# EAGLE design Dotblox64d (EAGLE 4.16)
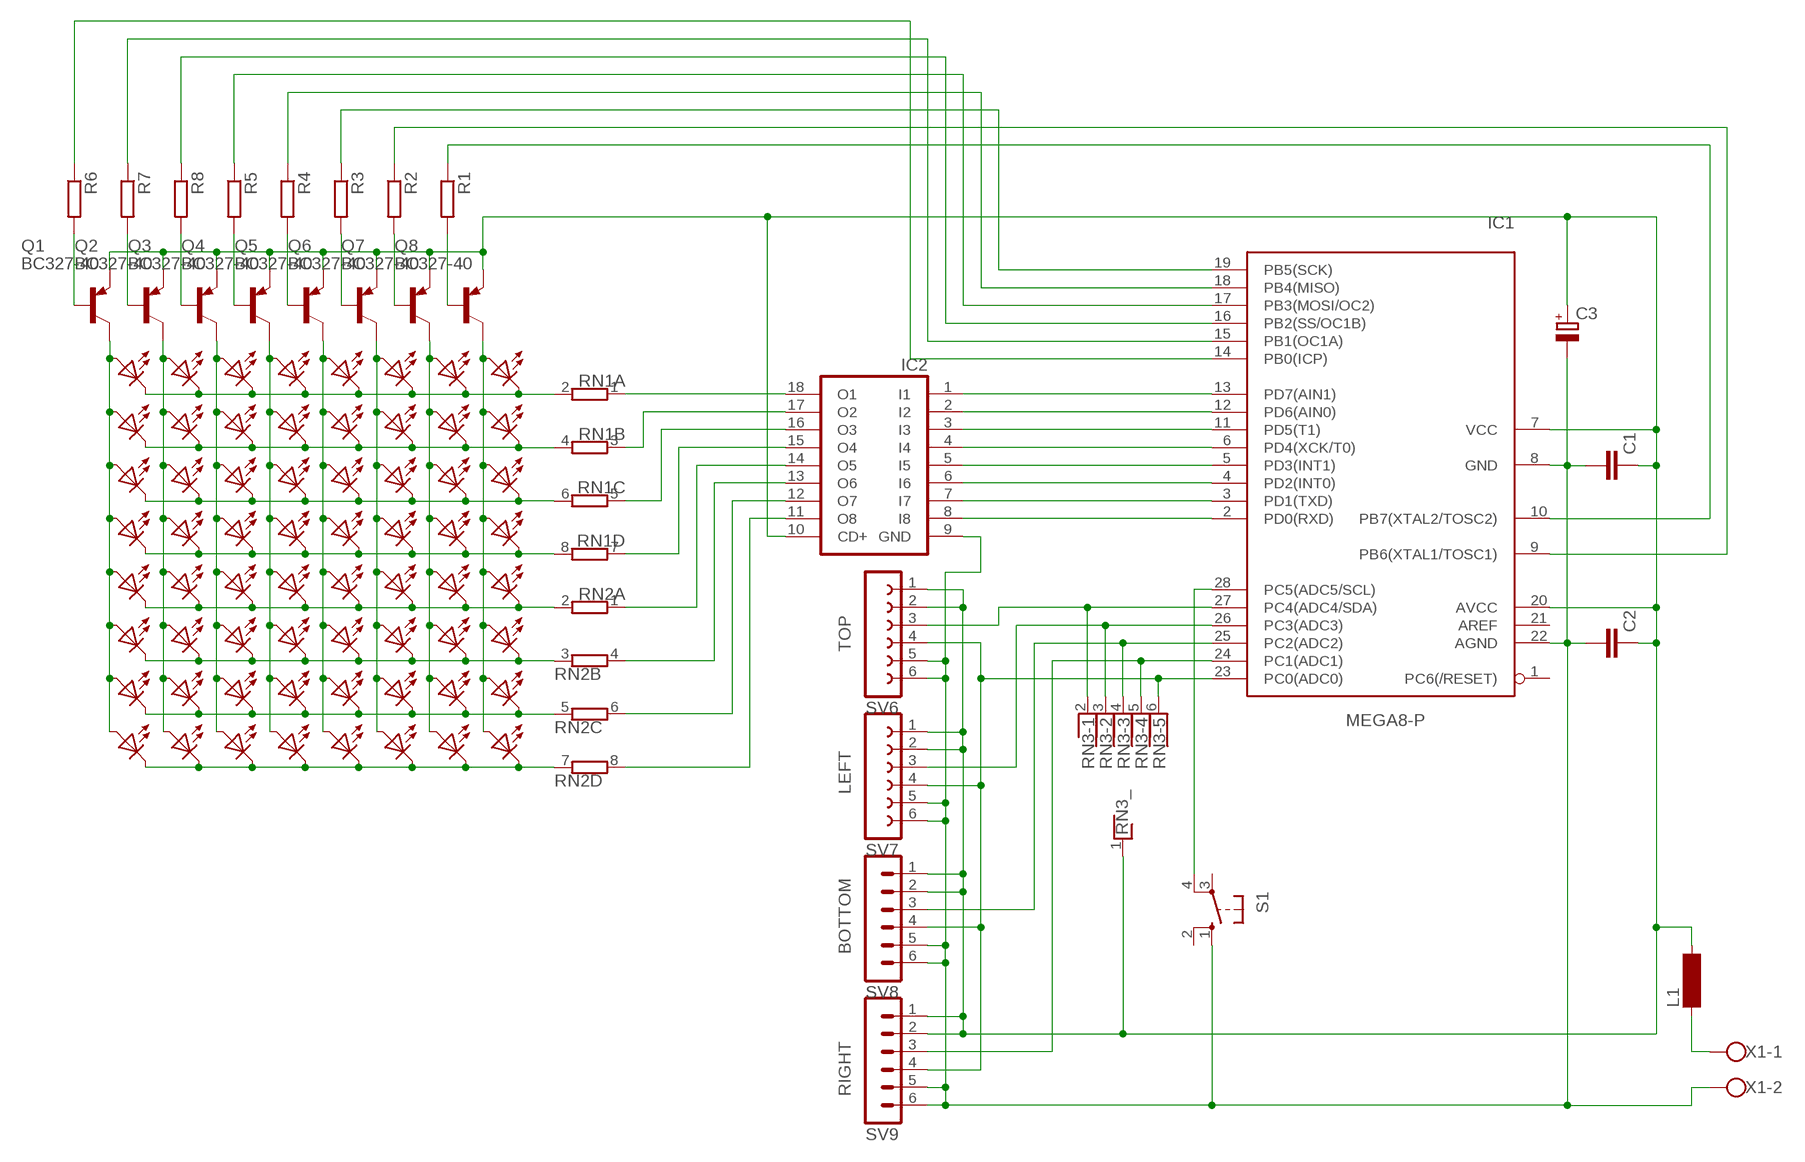
[diagram p0: schematic, sheet 1]

## Parts
C1  C-EU025-025X050  [C025-025X050]
C2  C-EU025-025X050  [C025-025X050]
C3  CPOL-EUE3.5-8  [E3,5-8]
IC1  MEGA8-P  [DIL28-3]
IC2  ULN2803A  [DIL18]
L1  BS11  [BS11]
LED1  LED_MATRIX_5MM  [LED_5MM]
LED2  LED_MATRIX_5MM  [LED_5MM]
LED3  LED_MATRIX_5MM  [LED_5MM]
LED4  LED_MATRIX_5MM  [LED_5MM]
LED5  LED_MATRIX_5MM  [LED_5MM]
LED6  LED_MATRIX_5MM  [LED_5MM]
LED7  LED_MATRIX_5MM  [LED_5MM]
LED8  LED_MATRIX_5MM  [LED_5MM]
LED9  LED_MATRIX_5MM  [LED_5MM]
LED10  LED_MATRIX_5MM  [LED_5MM]
LED11  LED_MATRIX_5MM  [LED_5MM]
LED12  LED_MATRIX_5MM  [LED_5MM]
LED13  LED_MATRIX_5MM  [LED_5MM]
LED14  LED_MATRIX_5MM  [LED_5MM]
LED15  LED_MATRIX_5MM  [LED_5MM]
LED16  LED_MATRIX_5MM  [LED_5MM]
LED17  LED_MATRIX_5MM  [LED_5MM]
LED18  LED_MATRIX_5MM  [LED_5MM]
LED19  LED_MATRIX_5MM  [LED_5MM]
LED20  LED_MATRIX_5MM  [LED_5MM]
LED21  LED_MATRIX_5MM  [LED_5MM]
LED22  LED_MATRIX_5MM  [LED_5MM]
LED23  LED_MATRIX_5MM  [LED_5MM]
LED24  LED_MATRIX_5MM  [LED_5MM]
LED25  LED_MATRIX_5MM  [LED_5MM]
LED26  LED_MATRIX_5MM  [LED_5MM]
LED27  LED_MATRIX_5MM  [LED_5MM]
LED28  LED_MATRIX_5MM  [LED_5MM]
LED29  LED_MATRIX_5MM  [LED_5MM]
LED30  LED_MATRIX_5MM  [LED_5MM]
LED31  LED_MATRIX_5MM  [LED_5MM]
LED32  LED_MATRIX_5MM  [LED_5MM]
LED33  LED_MATRIX_5MM  [LED_5MM]
LED34  LED_MATRIX_5MM  [LED_5MM]
LED35  LED_MATRIX_5MM  [LED_5MM]
LED36  LED_MATRIX_5MM  [LED_5MM]
LED37  LED_MATRIX_5MM  [LED_5MM]
LED38  LED_MATRIX_5MM  [LED_5MM]
LED39  LED_MATRIX_5MM  [LED_5MM]
LED40  LED_MATRIX_5MM  [LED_5MM]
LED41  LED_MATRIX_5MM  [LED_5MM]
LED42  LED_MATRIX_5MM  [LED_5MM]
LED43  LED_MATRIX_5MM  [LED_5MM]
LED44  LED_MATRIX_5MM  [LED_5MM]
LED45  LED_MATRIX_5MM  [LED_5MM]
LED46  LED_MATRIX_5MM  [LED_5MM]
LED47  LED_MATRIX_5MM  [LED_5MM]
LED48  LED_MATRIX_5MM  [LED_5MM]
LED49  LED_MATRIX_5MM  [LED_5MM]
LED50  LED_MATRIX_5MM  [LED_5MM]
LED51  LED_MATRIX_5MM  [LED_5MM]
LED52  LED_MATRIX_5MM  [LED_5MM]
LED53  LED_MATRIX_5MM  [LED_5MM]
LED54  LED_MATRIX_5MM  [LED_5MM]
LED55  LED_MATRIX_5MM  [LED_5MM]
LED56  LED_MATRIX_5MM  [LED_5MM]
LED57  LED_MATRIX_5MM  [LED_5MM]
LED58  LED_MATRIX_5MM  [LED_5MM]
LED59  LED_MATRIX_5MM  [LED_5MM]
LED60  LED_MATRIX_5MM  [LED_5MM]
LED61  LED_MATRIX_5MM  [LED_5MM]
LED62  LED_MATRIX_5MM  [LED_5MM]
LED63  LED_MATRIX_5MM  [LED_5MM]
LED64  LED_MATRIX_5MM  [LED_5MM]
Q1  BC327-40  [TO92-EBC]
Q2  BC327-40  [TO92-EBC]
Q3  BC327-40  [TO92-EBC]
Q4  BC327-40  [TO92-EBC]
Q5  BC327-40  [TO92-EBC]
Q6  BC327-40  [TO92-EBC]
Q7  BC327-40  [TO92-EBC]
Q8  BC327-40  [TO92-EBC]
R1  R-EU_0207/7  [0207/7]
R2  R-EU_0207/7  [0207/7]
R3  R-EU_0207/7  [0207/7]
R4  R-EU_0207/7  [0207/7]
R5  R-EU_0207/7  [0207/7]
R6  R-EU_0207/7  [0207/7]
R7  R-EU_0207/7  [0207/7]
R8  R-EU_0207/7  [0207/7]
RN1  E4R  [SIL8]
RN2  E4R  [SIL8]
RN3  RNX5  [RN-6]
S1  10-XX  [B3F-10XX]
SV6  TOP  FE06W  [FE06W]
SV7  LEFT  FE06W  [FE06W]
SV8  BOTTOM  MA06-1  [MA06-1]
SV9  RIGHT  MA06-1  [MA06-1]
X1  W237-02P  [W237-132]

## Nets
+5V: C1.1 C2.1 C3.+ IC1.7(VCC) IC1.20(AVCC) IC2.10(CD+) L1.2 Q1.E Q2.E Q3.E Q4.E Q5.E Q6.E Q7.E Q8.E RN3.1 SV6.1 SV6.2 SV7.1 SV7.2 SV8.1 SV8.2 SV9.1 SV9.2
GND: C1.2 C2.2 C3.- IC1.8(GND) IC1.22(AGND) IC2.9(GND) S1.1(S) SV6.5 SV6.6 SV7.5 SV7.6 SV8.5 SV8.6 SV9.5 SV9.6 X1.2
N$1: LED1.K(C) LED9.K(C) LED17.K(C) LED25.K(C) LED33.K(C) LED41.K(C) LED49.K(C) LED57.K(C) RN1.2
N$2: LED2.K(C) LED10.K(C) LED18.K(C) LED26.K(C) LED34.K(C) LED42.K(C) LED50.K(C) LED58.K(C) RN1.4
N$3: LED3.K(C) LED11.K(C) LED19.K(C) LED27.K(C) LED35.K(C) LED43.K(C) LED51.K(C) LED59.K(C) RN1.6
N$4: LED4.K(C) LED12.K(C) LED20.K(C) LED28.K(C) LED36.K(C) LED44.K(C) LED52.K(C) LED60.K(C) RN1.8
N$5: LED5.K(C) LED13.K(C) LED21.K(C) LED29.K(C) LED37.K(C) LED45.K(C) LED53.K(C) LED61.K(C) RN2.2
N$6: LED6.K(C) LED14.K(C) LED22.K(C) LED30.K(C) LED38.K(C) LED46.K(C) LED54.K(C) LED62.K(C) RN2.3
N$7: LED7.K(C) LED15.K(C) LED23.K(C) LED31.K(C) LED39.K(C) LED47.K(C) LED55.K(C) LED63.K(C) RN2.5
N$8: LED8.K(C) LED16.K(C) LED24.K(C) LED32.K(C) LED40.K(C) LED48.K(C) LED56.K(C) LED64.K(C) RN2.7
N$9: LED1.A LED2.A LED3.A LED4.A LED5.A LED6.A LED7.A LED8.A Q1.C
N$10: LED9.A LED10.A LED11.A LED12.A LED13.A LED14.A LED15.A LED16.A Q2.C
N$11: LED17.A LED18.A LED19.A LED20.A LED21.A LED22.A LED23.A LED24.A Q3.C
N$12: LED25.A LED26.A LED27.A LED28.A LED29.A LED30.A LED31.A LED32.A Q4.C
N$13: LED33.A LED34.A LED35.A LED36.A LED37.A LED38.A LED39.A LED40.A Q5.C
N$14: LED41.A LED42.A LED43.A LED44.A LED45.A LED46.A LED47.A LED48.A Q6.C
N$15: LED49.A LED50.A LED51.A LED52.A LED53.A LED54.A LED55.A LED56.A Q7.C
N$16: LED57.A LED58.A LED59.A LED60.A LED61.A LED62.A LED63.A LED64.A Q8.C
N$17: IC2.18(O1) RN1.1
N$18: IC2.17(O2) RN1.3
N$19: IC2.16(O3) RN1.5
N$20: IC2.15(O4) RN1.7
N$21: IC2.14(O5) RN2.1
N$22: IC2.13(O6) RN2.4
N$23: IC2.12(O7) RN2.6
N$24: IC2.11(O8) RN2.8
N$25: IC1.13(PD7(AIN1)) IC2.1(I1)
N$26: IC1.12(PD6(AIN0)) IC2.2(I2)
N$27: IC1.11(PD5(T1)) IC2.3(I3)
N$28: IC1.6(PD4(XCK/T0)) IC2.4(I4)
N$29: IC1.5(PD3(INT1)) IC2.5(I5)
N$30: IC1.4(PD2(INT0)) IC2.6(I6)
N$31: IC1.3(PD1(TXD)) IC2.7(I7)
N$32: IC1.2(PD0(RXD)) IC2.8(I8)
N$33: IC1.28(PC5(ADC5/SCL)) S1.4(P1)
N$34: IC1.9(PB6(XTAL1/TOSC1)) R2.1
N$35: IC1.19(PB5(SCK)) R3.1
N$36: L1.1 X1.1
N$37: IC1.10(PB7(XTAL2/TOSC2)) R1.1
N$38: IC1.18(PB4(MISO)) R4.1
N$39: IC1.17(PB3(MOSI/OC2)) R5.1
N$40: IC1.16(PB2(SS/OC1B)) R8.1
N$41: IC1.15(PB1(OC1A)) R7.1
N$42: IC1.14(PB0(ICP)) R6.1
N$43: Q8.B R1.2
N$44: Q7.B R2.2
N$45: Q5.B R4.2
N$46: Q6.B R3.2
N$47: Q4.B R5.2
N$48: Q1.B R6.2
N$49: Q2.B R7.2
N$50: Q3.B R8.2
N$51: IC1.24(PC1(ADC1)) RN3.5 SV9.3
N$52: IC1.26(PC3(ADC3)) RN3.3 SV7.3
N$53: IC1.27(PC4(ADC4/SDA)) RN3.2 SV6.3
N$54: IC1.25(PC2(ADC2)) RN3.4 SV8.3
N$56: IC1.23(PC0(ADC0)) RN3.6 SV6.4 SV7.4 SV8.4 SV9.4
Unconnected: IC1.1(PC6(/RESET)) IC1.21(AREF) S1.2(S1) S1.3(P)

## Library data of the parts
C1 C2 = rcl:C-EU: CAPACITOR, European symbol
C3 = rcl:CPOL-EU: POLARIZED CAPACITOR, European symbol
IC1 = atmel:MEGA8-P: MICROCONTROLLER 8 Kbytes FLASH 1 kbytes SRAM 512 bytes EEPROM USART 4-channel 10 bit ADC 2-channel 8 bit ADC Source: avr.lbr
IC2 = uln-udn:ULN2803A: DRIVER ARRAY
L1 = inductor-neosid:BS: INDUCTOR nominal inductance, magnetically screened
LED1-LED64 = _custom:LED_MATRIX_5MM
Q1-Q8 = transistor-pnp:BC327*: PNP Transistror
R1-R8 = rcl:R-EU_: RESISTOR, European symbol
RN1 RN2 = resistor-sil:E4R: SIL RESISTOR
RN3 = resistor-net:RNX5: RESISTOR NETWORK
S1 = switch-omron:10-XX: OMRON SWITCH
SV6 SV7 = con-lsta:FE06W: FEMALE HEADER
SV8 SV9 = con-lstb:MA06-1: PIN HEADER
X1 = con-wago-508:W237-02P: WAGO SREW CLAMP

## Board
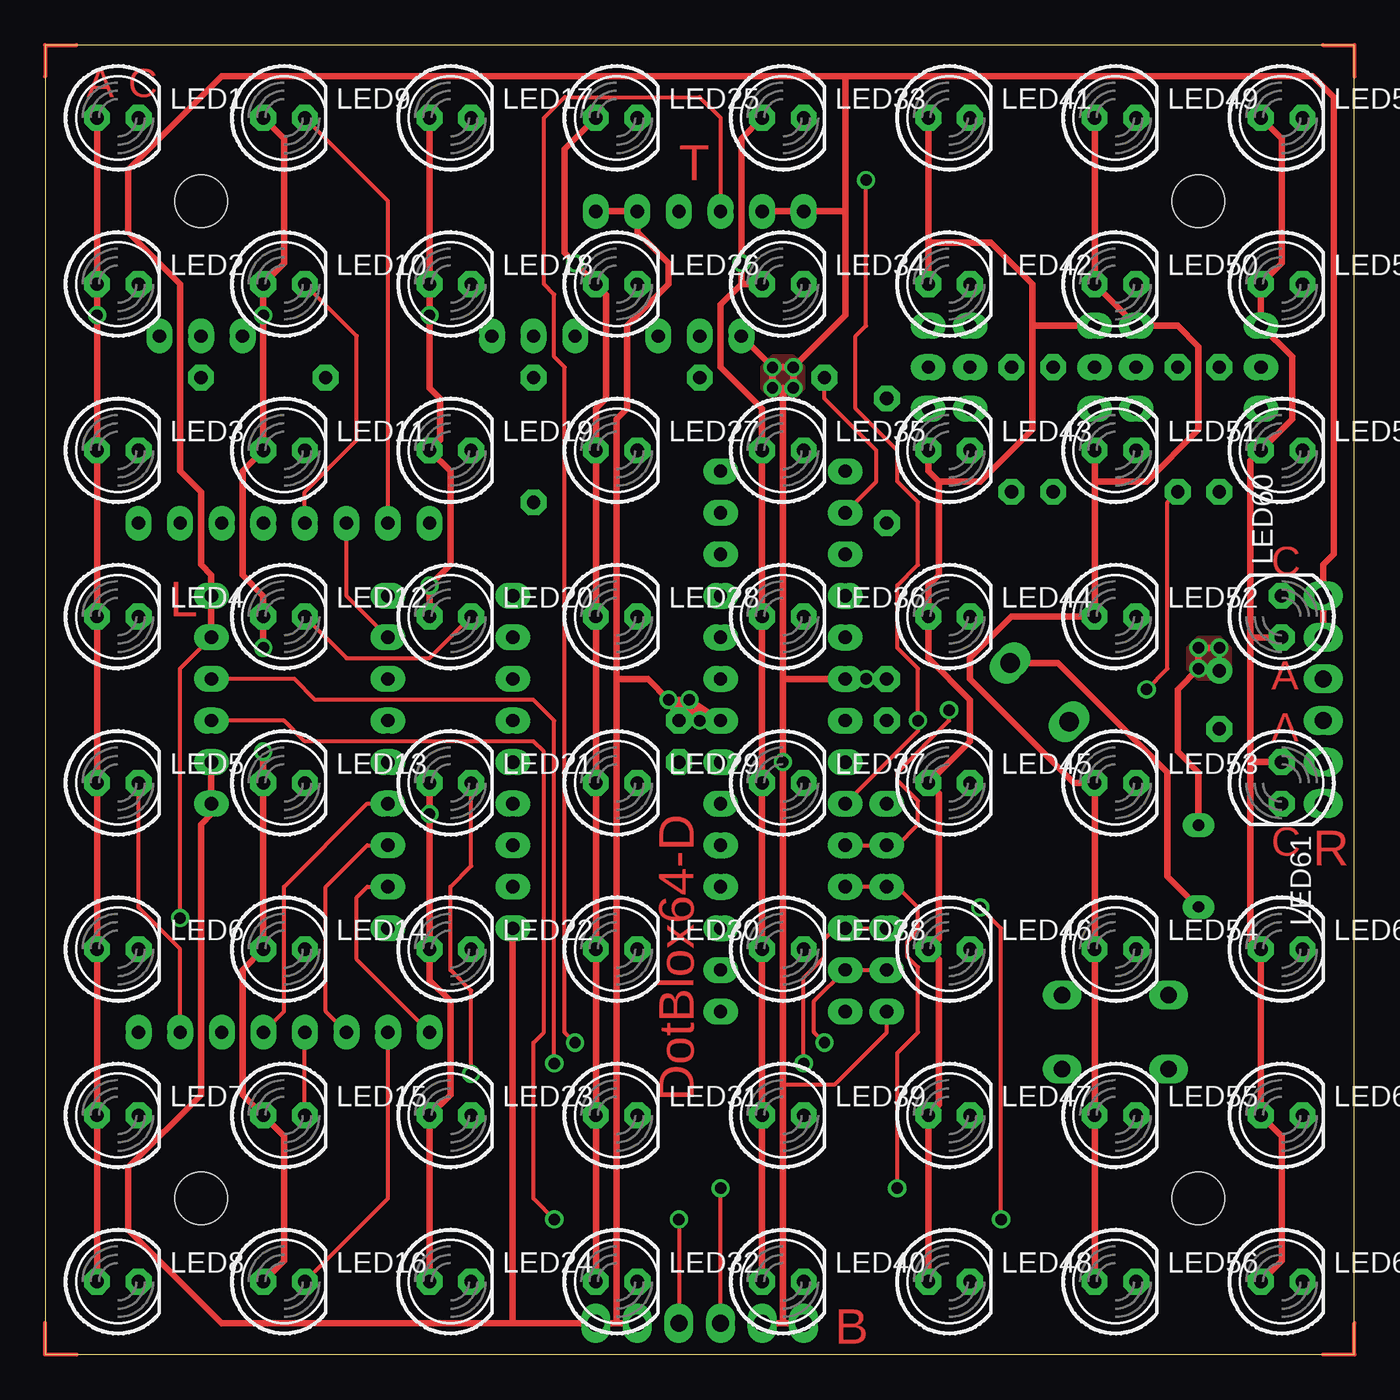
[diagram p1: board, top side]
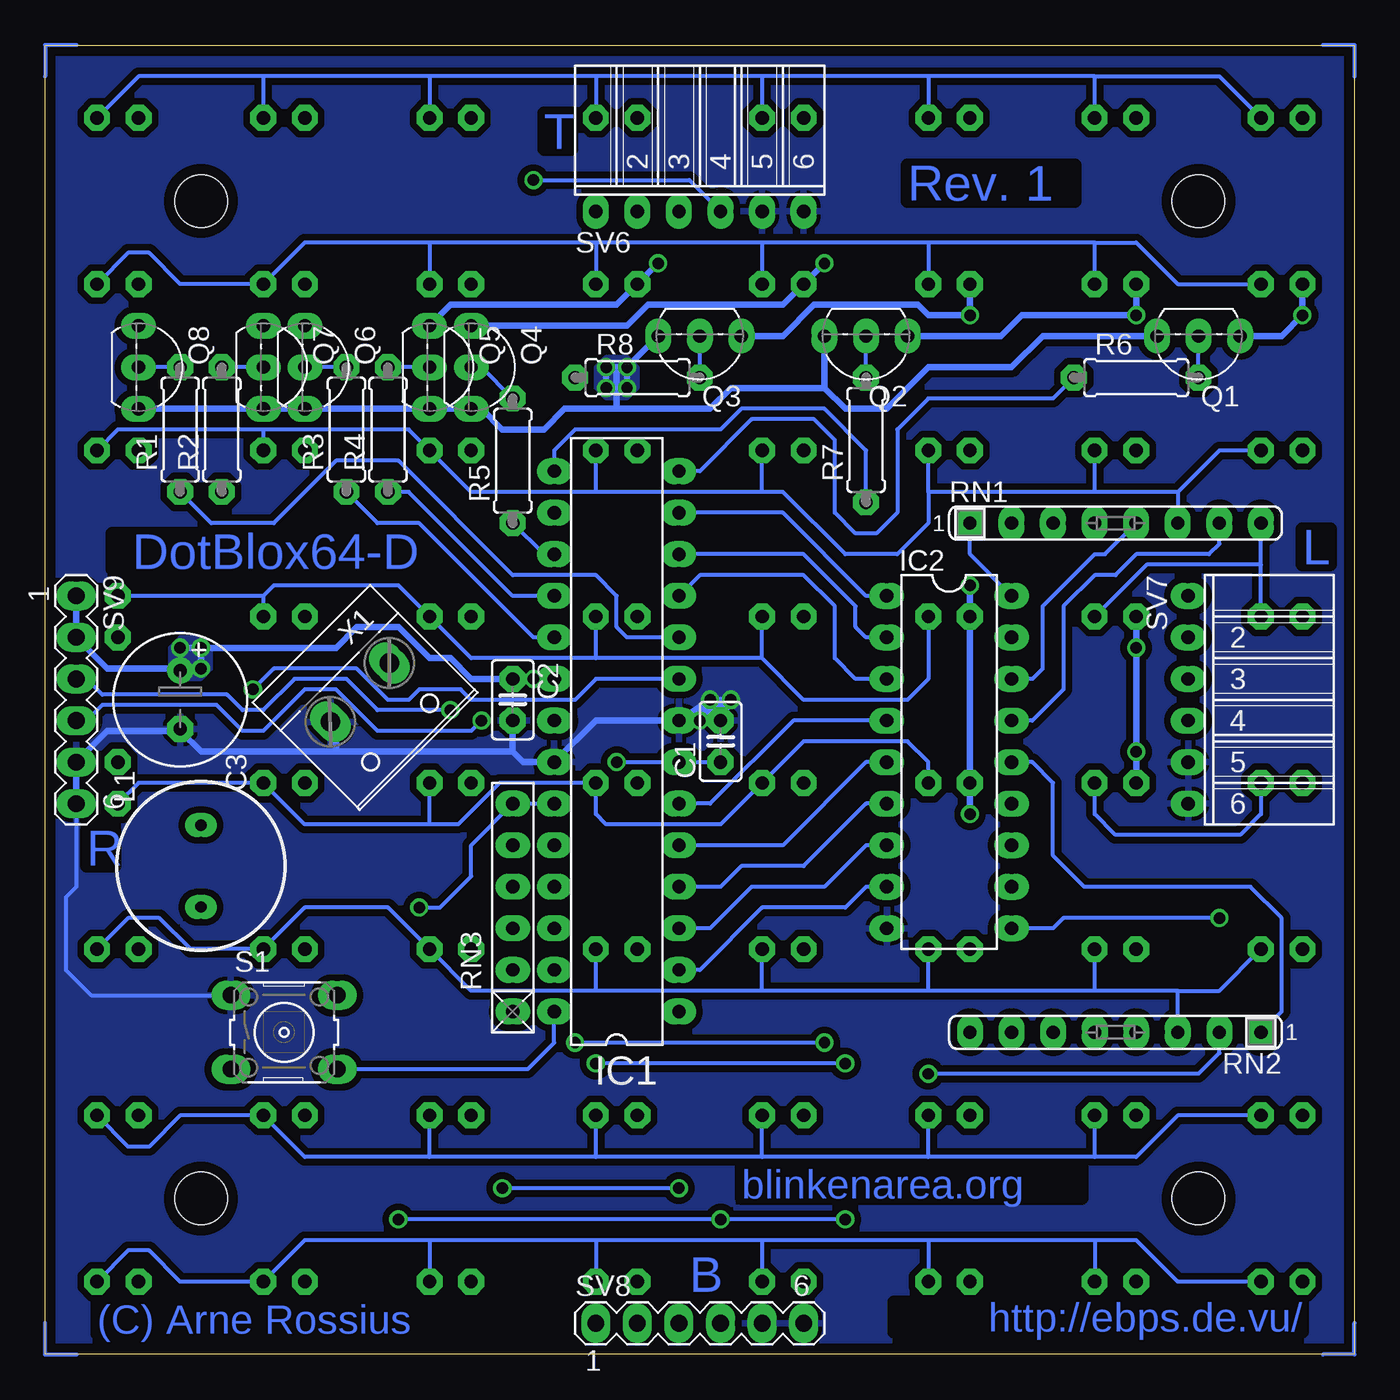
[diagram p2: board, bottom side, seen from below]

Size 80.01 x 80.01 mm. Coordinates in mm from the lower left corner, seen from the top.
Outline: 0,0 80.01,0 80.01,80.01 0,80.01 0,0
Copper layers (1*16): Top 0.035mm / dielectric 1.5mm / Bottom 0.035mm
Design rules "Bilex": minimum track width 10mil, minimum drill 24mil, track to track 10mil, track to pad 10mil, pad to pad 10mil, via to via 10mil, smd to smd 10mil, copper to edge 25mil, drill to drill 8mil, minimum pad ring 15mil, minimum via ring 8mil, stop-mask expansion 4mil, vias tented up to drill 30mil, thermal gap 10mil
Holes 3.2 mm at 9.53,70.48 70.48,70.48 70.48,9.53 9.53,9.53

### Footprints (pad centres in the part's own frame; a part is rotated, then mirrored left to right if it is on the bottom)
C025-025X050 = drill 0.813 octagon: 1 -1.27,0; 2 1.27,0
E3,5-8 = drill 0.813 pad 1.6 round: + -1.778,0 | drill 0.813 pad 1.6 octagon: - 1.778,0
DIL28-3 = drill 0.813 long: 1 -16.51,-3.81; 2 -13.97,-3.81; 3 -11.43,-3.81; 4 -8.89,-3.81; 5 -6.35,-3.81; 6 -3.81,-3.81; 7 -1.27,-3.81; 8 1.27,-3.81; 9 3.81,-3.81; 10 6.35,-3.81; 11 8.89,-3.81; 12 11.43,-3.81; 13 13.97,-3.81; 14 16.51,-3.81; 15 16.51,3.81; 16 13.97,3.81; 17 11.43,3.81; 18 8.89,3.81; 19 6.35,3.81; 20 3.81,3.81; 21 1.27,3.81; 22 -1.27,3.81; 23 -3.81,3.81; 24 -6.35,3.81; 25 -8.89,3.81; 26 -11.43,3.81; 27 -13.97,3.81; 28 -16.51,3.81
DIL18 = drill 0.813 long: 1 -10.16,-3.81; 2 -7.62,-3.81; 3 -5.08,-3.81; 4 -2.54,-3.81; 5 0,-3.81; 6 2.54,-3.81; 7 5.08,-3.81; 8 7.62,-3.81; 9 10.16,-3.81; 10 10.16,3.81; 11 7.62,3.81; 12 5.08,3.81; 13 2.54,3.81; 14 0,3.81; 15 -2.54,3.81; 16 -5.08,3.81; 17 -7.62,3.81; 18 -10.16,3.81
BS11 = drill 0.7 long: 1 -2.5,0; 2 2.5,0
LED_5MM = drill 0.813 octagon: A -1.27,0; K 1.27,0
TO92-EBC = drill 0.813 long: B 0,-1.27; C -2.54,-1.27; E 2.54,-1.27
0207/7 = drill 0.813 octagon: 1 -3.81,0; 2 3.81,0
SIL8 = drill 0.813 long: 1 -8.89,0; 2 -6.35,0; 3 -3.81,0; 4 -1.27,0; 5 1.27,0; 6 3.81,0; 7 6.35,0; 8 8.89,0
RN-6 = drill 0.813 long: 1 -6.35,0; 2 -3.81,0; 3 -1.27,0; 4 1.27,0; 5 3.81,0; 6 6.35,0
B3F-10XX = drill 1.016 long: 1 -3.251,2.261; 2 3.251,2.261; 3 -3.251,-2.261; 4 3.251,-2.261
FE06W = drill 0.813 long: 1 -6.35,0; 2 -3.81,0; 3 -1.27,0; 4 1.27,0; 5 3.81,0; 6 6.35,0
MA06-1 = drill 1.016 long: 1 -6.35,0; 2 -3.81,0; 3 -1.27,0; 4 1.27,0; 5 3.81,0; 6 6.35,0
W237-132 = drill 1.194 long: 1 -2.54,-0.635; 2 2.54,-0.635

### Placement (x,y rotation side)
C1  38.73,37.47 90 bottom
C2  51.44,40.01 270 bottom
C3  71.75,40.01 270 bottom
IC1  45.09,37.47 90 bottom
IC2  24.77,36.2 270 bottom
L1  70.48,29.84 90 bottom
LED1  4.45,75.56 0 top
LED2  4.45,65.41 0 top
LED3  4.45,55.24 0 top
LED4  4.45,45.09 0 top
LED5  4.45,34.92 0 top
LED6  4.45,24.77 0 top
LED7  4.45,14.61 0 top
LED8  4.45,4.45 0 top
LED9  14.61,75.56 0 top
LED10  14.61,65.41 0 top
LED11  14.61,55.24 0 top
LED12  14.61,45.09 0 top
LED13  14.61,34.92 0 top
LED14  14.61,24.77 0 top
LED15  14.61,14.61 0 top
LED16  14.61,4.45 0 top
LED17  24.77,75.56 0 top
LED18  24.77,65.41 0 top
LED19  24.77,55.24 0 top
LED20  24.77,45.09 0 top
LED21  24.77,34.92 0 top
LED22  24.77,24.77 0 top
LED23  24.77,14.61 0 top
LED24  24.77,4.45 0 top
LED25  34.92,75.56 0 top
LED26  34.92,65.41 0 top
LED27  34.92,55.24 0 top
LED28  34.92,45.09 0 top
LED29  34.92,34.92 0 top
LED30  34.92,24.77 0 top
LED31  34.92,14.61 0 top
LED32  34.92,4.45 0 top
LED33  45.09,75.56 0 top
LED34  45.09,65.41 0 top
LED35  45.09,55.24 0 top
LED36  45.09,45.09 0 top
LED37  45.09,34.92 0 top
LED38  45.09,24.77 0 top
LED39  45.09,14.61 0 top
LED40  45.09,4.45 0 top
LED41  55.24,75.56 0 top
LED42  55.24,65.41 0 top
LED43  55.24,55.24 0 top
LED44  55.24,45.09 0 top
LED45  55.24,34.92 0 top
LED46  55.24,24.77 0 top
LED47  55.24,14.61 0 top
LED48  55.24,4.45 0 top
LED49  65.41,75.56 0 top
LED50  65.41,65.41 0 top
LED51  65.41,55.24 0 top
LED52  65.41,45.09 0 top
LED53  65.41,34.92 0 top
LED54  65.41,24.77 0 top
LED55  65.41,14.61 0 top
LED56  65.41,4.45 0 top
LED57  75.56,75.56 0 top
LED58  75.56,65.41 0 top
LED59  75.56,55.24 0 top
LED60  75.56,45.09 90 top
LED61  75.56,34.92 270 top
LED62  75.56,24.77 0 top
LED63  75.56,14.61 0 top
LED64  75.56,4.45 0 top
Q1  9.53,60.96 180 bottom
Q2  29.84,60.96 180 bottom
Q3  40.01,60.96 180 bottom
Q4  52.7,60.33 270 bottom
Q5  55.24,60.33 270 bottom
Q6  62.87,60.33 270 bottom
Q7  65.41,60.33 270 bottom
Q8  73.03,60.33 270 bottom
R1  71.75,56.52 90 bottom
R2  69.22,56.52 90 bottom
R3  61.59,56.52 90 bottom
R4  59.05,56.52 90 bottom
R5  51.44,54.61 90 bottom
R6  13.34,59.69 0 bottom
R7  29.84,55.88 90 bottom
R8  43.81,59.69 0 bottom
RN1  14.61,50.8 0 bottom
RN2  14.61,19.68 180 bottom
RN3  51.44,27.3 90 bottom
S1  65.41,19.68 0 bottom
SV6  40.01,69.85 0 bottom
SV7  10.16,40.01 270 bottom
SV8  40.01,1.91 0 bottom
SV9  78.11,40.01 270 bottom
X1  60.33,40.01 225 bottom

### Tracks (layer width: path | path; a pad name or v marks a point on that pad's centre or on a via)
+5V  (via drill 0.7)
  Top 0.254: v8.26,26.67 8.26,41.91 SV7.2 | RN3.1 51.44,19.68 48.26,16.51 45.09,16.51
  Top 0.406: 48.9,78.11 10.79,78.11 5.08,72.39 5.08,68.58 8.26,65.41 8.26,53.98 9.53,52.7 9.53,48.26 10.16,47.62 SV7.1 SV7.2 | 45.09,41.27 v45.09,36.2 45.09,16.51 45.09,1.91 | 48.9,78.11 77.47,78.11 78.74,76.83 78.74,48.9 78.11,48.26 SV9.1 SV9.2 | 45.09,41.27 v50.16,41.27 | v50.16,41.27 C2.1 v50.16,41.27 | v50.16,41.27 IC1.20 | 45.09,41.27 45.09,59.05 v45.72,59.05 v45.72,60.33 | v45.72,60.33 v44.45,60.33 | v45.72,60.33 48.9,63.5 48.9,69.85 | 48.9,78.11 48.9,69.85 | v44.45,60.33 Q3.E | v44.45,60.33 45.09,60.33 | v45.72,60.33 v44.45,60.33 | v45.72,60.33 v44.45,60.33 | v45.72,60.33 v44.45,60.33 | v44.45,60.33 v44.45,59.05 v44.45,60.33 | SV6.2 SV6.1 48.9,69.85 | 45.09,1.91 SV8.1 | 45.09,1.91 SV8.2 | L1.2 70.48,35.56 69.22,36.83 69.22,40.64 v70.48,41.91 | C3.+ 71.75,41.91 v70.48,41.91 | v70.48,41.91 v70.48,43.18 v71.75,43.18
  Bottom 0.254: v45.09,36.2 IC1.7 C1.1 | IC2.10 18.41,26.04 17.78,26.67 v8.26,26.67
  Bottom 0.406: Q8.E Q7.E Q6.E Q5.E Q4.E 53.34,57.78 52.07,56.52 49.53,56.52 48.26,57.78 45.09,57.78 | 45.09,57.78 39.37,57.78 38.1,59.05 32.38,59.05 | v45.72,60.33 45.09,60.33 45.09,57.78 | Q1.E 19.05,62.23 20.95,60.33 26.04,60.33 28.57,57.78 31.11,57.78 32.38,59.05 | 32.38,59.05 Q2.E | v44.45,60.33 Q3.E | v45.72,59.05 v44.45,59.05 | v45.72,59.05 v44.45,59.05 | v45.72,60.33 v45.72,59.05 | v45.72,60.33 v44.45,60.33 | v45.72,60.33 v44.45,60.33 | v45.72,60.33 v45.72,59.05 | v45.72,59.05 v44.45,59.05 | v44.45,60.33 v44.45,59.05 | v45.72,60.33 v44.45,60.33 | v45.72,60.33 v44.45,60.33 | IC1.20 v50.16,41.27 C2.1 53.98,41.27 55.24,42.55 56.52,42.55 58.42,44.45 60.96,44.45 62.23,43.18 v70.48,43.18 | SV9.2 SV9.1 SV9.2 | SV9.2 76.2,41.91 71.75,41.91 | v70.48,43.18 v71.75,43.18 | 71.75,41.91 C3.+ | 71.75,41.91 v70.48,41.91 v70.48,43.18
  pour Top (no thermals): 43.81,60.33 43.81,59.05 44.45,58.42 45.72,58.42 46.35,59.05 46.35,60.33 45.72,60.96 44.45,60.96
  pour Bottom (no thermals): 43.81,60.33 43.81,59.05 44.45,58.42 45.72,58.42 46.35,59.05 46.35,60.33 45.72,60.96 44.45,60.96
  pour Bottom (isolate 0.406, no thermals): 70.48,43.81 71.75,43.81 72.39,43.18 72.39,41.91 71.75,41.27 70.48,41.27 69.85,41.91 69.85,43.18
  pour Top (no thermals): 70.48,43.81 71.75,43.81 72.39,43.18 72.39,41.91 71.75,41.27 70.48,41.27 69.85,41.91 69.85,43.18
GND  (via drill 0.7)
  Top 0.406: 34.92,41.27 36.83,41.27 v38.1,40.01 | 28.57,1.91 IC2.9 | 28.57,1.91 10.79,1.91 5.08,7.62 5.08,11.43 9.53,15.88 9.53,32.38 10.16,33.02 SV7.6 SV7.5 | 34.92,41.27 34.92,57.15 35.56,57.78 35.56,62.87 38.1,65.41 38.1,66.67 36.2,68.58 SV6.5 SV6.6 | v38.1,40.01 v39.37,40.01 | v40.01,38.73 IC1.8 | v39.37,40.01 IC1.8 | v39.37,40.01 40.01,39.37 | v39.37,40.01 39.37,39.37 | C1.2 v40.01,38.73 | C1.2 v40.01,38.73 | C1.2 v40.01,38.73 | v38.1,40.01 C1.2 | C1.2 v40.01,38.73 | v40.01,38.73 IC1.8 | C1.2 v40.01,38.73 | v40.01,38.73 IC1.8 | 34.92,1.91 SV8.6 28.57,1.91 | 34.92,1.91 SV8.5 | 34.92,1.91 34.92,41.27
  Top 0.813: v38.1,40.01 v40.01,38.73
  Bottom 0.254: S1.1 77.19,21.95 78.74,23.5 78.74,27.94 78.11,28.57 SV9.6
  Bottom 0.406: C1.2 v40.01,38.73 | v38.1,40.01 C1.2 | v38.1,40.01 C1.2 | v38.1,40.01 v39.37,40.01 | C1.2 v39.37,40.01 | C1.2 v40.01,38.73 | 40.64,38.73 IC1.8 v39.37,40.01 | v40.01,38.73 v39.37,40.01 | v39.37,40.01 40.64,38.73 | C1.2 v40.01,38.73 | v40.01,38.73 40.64,38.73 | 40.64,38.73 46.35,38.73 IC1.22 50.8,36.2 51.44,36.83 | 51.44,36.83 C2.2 | 71.75,38.1 76.2,38.1 SV9.5 SV9.6 | 71.75,38.1 70.48,36.83 62.23,36.83 | 71.75,38.1 C3.- | 51.44,36.83 62.23,36.83 | X1.2 62.23,38.32 62.23,36.83
  Bottom 0.813: v38.1,40.01 v40.01,38.73
  pour Bottom (isolate 0.406): 0,80.01 80.01,80.01 80.01,0 0,0
N$1
  Top 0.254: RN1.2 20.95,70.48 LED9.K
  Bottom 0.254: LED1.K 8.26,78.11 15.88,78.11 | 26.04,78.11 36.2,78.11 | 36.2,78.11 46.35,78.11 | 46.35,78.11 56.52,78.11 | 56.52,78.11 66.67,78.11 | 66.67,78.11 74.3,78.11 LED57.K | 66.67,78.11 LED49.K | 56.52,78.11 LED41.K | 46.35,78.11 LED33.K | 36.2,78.11 LED25.K | 26.04,78.11 LED17.K | 15.88,78.11 26.04,78.11 | LED9.K 15.88,78.11
N$2
  Top 0.254: LED10.K 19.05,62.23 19.05,55.88 15.88,52.7 RN1.4
  Bottom 0.254: LED58.K 74.93,67.31 73.66,67.31 71.75,65.41 LED50.K 64.14,67.94 56.52,67.94 | 15.88,67.94 13.34,67.94 10.79,65.41 LED2.K | 15.88,67.94 26.04,67.94 | 26.04,67.94 36.2,67.94 | 36.2,67.94 46.35,67.94 | 46.35,67.94 56.52,67.94 | LED10.K 15.88,67.94 | 26.04,67.94 LED18.K | 36.2,67.94 LED26.K | 46.35,67.94 LED34.K | 56.52,67.94 LED42.K
N$3
  Bottom 0.254: LED3.K 8.26,55.24 10.79,52.7 | 10.79,52.7 15.88,52.7 | 15.88,52.7 LED11.K | 15.88,52.7 26.04,52.7 | 26.04,52.7 26.04,50.8 27.94,48.9 31.11,48.9 34.92,52.7 36.2,52.7 | 36.2,52.7 46.35,52.7 | 46.35,52.7 53.98,52.7 LED43.K 57.78,56.52 66.67,56.52 | 66.67,56.52 75.56,56.52 LED59.K | 66.67,56.52 LED51.K | 46.35,52.7 LED35.K | 36.2,52.7 LED27.K | 26.04,52.7 LED19.K | 10.79,52.7 RN1.6
N$4
  Top 0.254: LED20.K 23.5,42.55 18.41,42.55 LED12.K
  Bottom 0.254: LED4.K 5.71,48.26 | 5.71,48.26 12.7,48.26 LED12.K | 36.2,42.55 33.66,40.01 27.3,40.01 26.04,41.27 LED20.K | 36.2,42.55 46.35,42.55 | 46.35,42.55 53.98,42.55 LED44.K 58.42,46.99 66.04,46.99 66.67,46.35 | 66.67,46.35 LED60.K | 66.67,46.35 LED52.K | 46.35,42.55 LED36.K | 36.2,42.55 LED28.K | 5.71,48.26 RN1.8
N$5  (via drill 0.7)
  Top 0.254: RN2.2 8.26,24.77 5.71,27.3 LED5.K | LED21.K 26.04,29.84 24.77,28.57 24.77,23.5 26.04,22.23 v26.04,17.14
  Bottom 0.254: LED5.K 5.71,33.02 6.99,31.75 14.61,31.75 15.88,33.02 LED13.K | 56.52,32.38 54.77,32.38 52.23,34.92 LED37.K 46.35,33.02 45.72,32.38 38.73,32.38 LED29.K 33.66,37.47 27.3,37.47 26.04,36.2 LED21.K | 56.52,32.38 64.14,32.38 LED53.K 74.3,34.92 LED61.K | 56.52,32.38 LED45.K | v26.04,17.14 9.53,17.14 8.26,18.41 RN2.2
N$6
  Bottom 0.254: LED6.K 8.26,22.23 10.79,22.23 | 10.79,22.23 15.88,22.23 | 15.88,22.23 26.04,22.23 | 26.04,22.23 36.2,22.23 | 36.2,22.23 LED30.K | 36.2,22.23 46.35,22.23 | 46.35,22.23 53.98,22.23 LED46.K 59.05,27.3 64.14,27.3 LED54.K 71.12,24.77 73.03,26.67 74.3,26.67 74.93,26.67 LED62.K | 46.35,22.23 LED38.K | 26.04,22.23 LED22.K | 15.88,22.23 LED14.K | RN2.3 10.79,22.23
N$7
  Top 0.254: LED15.K RN2.5
  Bottom 0.254: LED7.K 10.79,14.61 13.34,12.06 15.88,12.06 | 15.88,12.06 26.04,12.06 | 26.04,12.06 36.2,12.06 | 36.2,12.06 46.35,12.06 | 46.35,12.06 56.52,12.06 | 56.52,12.06 64.14,12.06 LED55.K 71.75,14.61 73.66,12.7 74.93,12.7 LED63.K | 56.52,12.06 LED47.K | 46.35,12.06 LED39.K | 36.2,12.06 LED31.K | 26.04,12.06 LED23.K | 15.88,12.06 LED15.K
N$8
  Top 0.254: LED16.K 20.95,9.53 RN2.7
  Bottom 0.254: LED8.K 10.79,4.45 13.34,6.99 15.88,6.99 | 15.88,6.99 26.04,6.99 | 26.04,6.99 36.2,6.99 | 36.2,6.99 46.35,6.99 | 46.35,6.99 56.52,6.99 | 56.52,6.99 64.14,6.99 LED56.K 71.75,4.45 73.66,6.35 74.93,6.35 LED64.K | 56.52,6.99 LED48.K | 46.35,6.99 LED40.K | 36.2,6.99 LED32.K | 26.04,6.99 LED24.K | 15.88,6.99 LED16.K
N$9  (via drill 0.7)
  Top 0.406: LED1.A LED2.A v3.17,63.5 LED3.A LED4.A LED5.A LED6.A LED7.A LED8.A
  Bottom 0.406: LED2.A v3.17,63.5 4.45,62.23 Q1.C
N$10  (via drill 0.7)
  Top 0.406: LED16.A 14.61,5.71 14.61,13.34 LED15.A 12.06,15.88 12.06,23.5 LED14.A LED13.A v13.34,36.83 | LED9.A 14.61,74.3 14.61,66.67 LED10.A v13.34,63.5 LED11.A 12.06,53.98 12.06,47.62 13.34,46.35 LED12.A v13.34,43.18
  Bottom 0.406: LED13.A v13.34,36.83 v13.34,43.18 LED12.A | LED10.A v13.34,63.5 20.32,63.5 21.59,62.23 Q2.C
N$11  (via drill 0.7)
  Top 0.406: LED24.A LED23.A 24.77,15.88 24.77,21.59 23.5,22.86 LED22.A v23.5,33.02 LED21.A | LED17.A LED18.A v23.5,63.5 23.5,59.05 24.13,58.42 24.13,55.88 LED19.A 24.77,53.98 24.77,48.26 v23.5,46.99 LED20.A
  Bottom 0.406: v23.5,33.02 LED21.A LED20.A v23.5,46.99 | LED18.A v23.5,63.5 26.04,63.5 26.67,64.14 33.02,64.14 34.92,62.23 Q3.C
N$12  (via drill 0.7)
  Top 0.406: LED32.A LED31.A LED30.A LED29.A LED28.A LED27.A 33.66,57.78 34.29,58.42 34.29,64.77 LED26.A v32.38,66.67 31.75,67.31 31.75,73.66 LED25.A
  Bottom 0.406: v32.38,66.67 LED26.A 34.92,64.14 43.18,64.14 44.45,62.87 Q4.C
N$13  (via drill 0.7)
  Top 0.406: LED40.A LED39.A LED38.A LED37.A LED36.A LED35.A 43.81,57.78 41.27,60.33 41.27,64.14 42.55,65.41 | 42.55,65.41 v42.55,66.67 42.55,74.3 LED33.A | 42.55,65.41 LED34.A
  Bottom 0.406: Q5.C 55.24,64.14 45.09,64.14 v42.55,66.67 LED34.A
N$14
  Top 0.406: LED48.A LED47.A 54.61,15.24 54.61,24.13 LED46.A 54.61,25.4 54.61,34.29 LED45.A 56.52,37.47 56.52,40.01 53.98,42.55 LED44.A 53.98,46.99 54.61,47.62 54.61,53.34 | 53.98,67.94 LED42.A | 53.98,67.94 LED41.A | 60.33,62.87 60.33,65.41 57.78,67.94 53.98,67.94 | 60.33,62.87 Q6.C | LED43.A 53.98,53.98 54.61,53.34 | 54.61,53.34 57.15,53.34 60.33,56.52 60.33,62.87
N$15
  Top 0.406: LED56.A LED55.A LED54.A LED53.A 62.87,34.92 56.52,41.27 56.52,42.55 59.05,45.09 LED52.A 64.14,53.34 | LED49.A LED50.A Q7.C 69.22,62.87 70.48,61.59 70.48,56.52 67.31,53.34 64.14,53.34 | 64.14,53.34 LED51.A 64.14,53.98
N$16
  Top 0.406: LED64.A 75.56,5.71 75.56,13.34 LED63.A LED62.A 73.66,25.4 73.66,36.2 | LED57.A 75.56,74.3 75.56,66.67 LED58.A Q8.C 76.2,60.96 76.2,57.15 LED59.A 73.66,54.61 73.66,43.81 | 73.66,36.2 73.66,43.81 | 73.66,43.81 LED60.A | 73.66,36.2 LED61.A
N$17
  Bottom 0.254: IC2.18 23.5,48.9 RN1.1
N$18
  Top 0.254: IC2.17 18.41,46.35 RN1.3
N$19
  Bottom 0.254: RN1.5 15.24,48.9 15.88,48.9 19.05,45.72 19.05,41.91 19.68,41.27 IC2.16
N$20
  Bottom 0.254: IC2.15 19.68,38.73 17.78,40.64 17.78,45.72 15.88,47.62 14.61,47.62 13.34,48.9 8.89,48.9 8.26,49.53 RN1.7
N$21
  Bottom 0.254: IC2.14 19.68,36.2 18.41,34.92 18.41,30.48 16.51,28.57 6.35,28.57 4.45,26.67 4.45,20.95 RN2.1
N$22
  Top 0.254: RN2.4 14.61,20.95 14.61,28.57 19.68,33.66 IC2.13
N$23
  Top 0.254: IC2.12 19.68,31.11 17.14,28.57 17.14,20.95 RN2.6
N$24
  Top 0.254: RN2.8 19.05,24.13 19.05,27.94 19.68,28.57 IC2.11
N$25
  Bottom 0.254: IC1.13 34.92,51.44 29.84,46.35 IC2.1
N$26
  Bottom 0.254: IC2.2 29.84,43.81 30.48,44.45 30.48,45.72 33.66,48.9 IC1.12
N$27
  Bottom 0.254: IC2.3 30.48,41.27 31.75,42.55 31.75,45.72 33.66,47.62 40.01,47.62 IC1.11
N$28
  Bottom 0.254: IC2.4 34.29,38.73 39.37,33.66 IC1.6
N$29
  Bottom 0.254: IC2.5 29.84,36.2 34.92,31.11 IC1.5
N$30
  Bottom 0.254: IC2.6 29.84,33.66 33.66,29.84 37.47,29.84 38.73,28.57 IC1.4
N$31
  Bottom 0.254: IC1.3 39.37,26.04 36.83,28.57 32.38,28.57 29.84,31.11 IC2.7
N$32
  Bottom 0.254: IC2.8 29.84,28.57 31.11,27.3 36.2,27.3 40.01,23.5 IC1.2
N$33
  Bottom 0.254: S1.4 50.52,17.42 48.9,19.05 IC1.28
N$34  (via drill 0.7)
  Top 0.254: v67.31,40.64 68.58,41.91 68.58,52.07 R2.1
  Bottom 0.254: IC1.9 46.35,41.27 47.62,40.01 53.98,40.01 54.61,40.64 57.15,40.64 57.78,40.01 59.05,40.01 60.96,41.91 66.04,41.91 v67.31,40.64
N$35
  Bottom 0.254: IC1.19 50.16,43.81 57.15,50.8 59.69,50.8 R3.1
N$36
  Top 0.406: 62.87,41.27 68.58,35.56 68.58,29.21 70.48,27.3 L1.1 | 62.87,41.27 62.79,41.35 | X1.1 61.89,42.25 62.87,41.27
N$37
  Bottom 0.254: IC1.10 44.45,43.81 45.09,44.45 45.09,46.35 46.35,47.62 51.44,47.62 58.42,54.61 62.23,54.61 66.04,50.8 69.85,50.8 R1.1
N$38
  Bottom 0.254: IC1.18 51.44,46.35 57.78,52.7 R4.1
N$39
  Bottom 0.254: IC1.17 49.53,48.9 R5.1
N$40
  Top 0.254: IC1.16 50.8,53.34 50.8,55.24 47.62,58.42 R8.1
N$41
  Bottom 0.254: IC1.15 48.9,55.24 47.62,56.52 38.73,56.52 37.47,57.78 32.38,57.78 29.84,55.24 R7.1
N$42
  Bottom 0.254: IC1.14 40.01,53.98 36.83,57.15 33.02,57.15 31.75,55.88 31.75,51.44 30.48,50.16 29.21,50.16 27.94,51.44 27.94,56.52 26.04,58.42 18.41,58.42 R6.1
N$43
  Bottom 0.254: R1.2 Q8.B
N$44
  Bottom 0.254: Q7.B R2.2
N$45
  Bottom 0.254: Q5.B R4.2
N$46
  Bottom 0.254: R3.2 Q6.B
N$47
  Bottom 0.254: R5.2 53.34,60.33 Q4.B
N$48
  Bottom 0.254: R6.2 Q1.B
N$49
  Bottom 0.254: R7.2 Q2.B
N$50
  Bottom 0.254: R8.2 Q3.B
N$51  (via drill 0.7)
  Top 0.254: IC1.24 RN3.5 52.07,31.11 53.34,32.38 53.34,33.81 52.07,35.08 52.07,35.56 55.24,38.73 v55.24,39.37
  Bottom 0.254: v55.24,39.37 59.69,39.37 61.59,41.27 64.77,41.27 66.67,39.37 67.94,39.37 68.9,40.32 76.52,40.32 77.47,41.27 SV9.3
N$52  (via drill 0.7)
  Top 0.254: v31.11,17.78 31.11,38.73 29.84,40.01 16.51,40.01 15.24,41.27 SV7.3 | v46.35,17.78 46.35,23.02 47.62,24.29 47.62,25.4 48.26,26.04 IC1.26 RN3.3
  Bottom 0.254: v31.11,17.78 v46.35,17.78
N$53  (via drill 0.7)
  Top 0.254: v32.38,19.05 31.75,19.68 31.75,60.33 31.11,60.96 31.11,64.77 30.48,65.41 30.48,75.56 31.75,76.83 40.01,76.83 41.27,75.56 SV6.3 | v47.62,19.05 46.99,19.68 46.99,21.59 IC1.27 RN3.2
  Bottom 0.254: v32.38,19.05 v47.62,19.05
N$54  (via drill 0.7)
  Top 0.254: IC1.25 RN3.4 52.07,28.57 53.34,27.3 53.34,25.88 52.7,25.24 52.7,24.29 53.34,23.65 53.34,19.68 52.07,18.41 v52.07,10.16 | SV8.3 v41.27,10.16
  Bottom 0.254: v41.27,10.16 v52.07,10.16
N$55
  Top 0.254: 1.91,80.01 0,80.01 0,78.11
N$56  (via drill 0.7)
  Top 0.254: IC1.23 53.34,38.1 v53.34,38.73 53.34,41.91 52.07,43.18 52.07,46.99 53.34,48.26 53.34,52.07 52.07,53.34 52.07,55.24 49.53,57.78 49.53,62.23 50.16,62.87 v50.16,71.75 | v58.42,8.26 58.42,26.04 v57.15,27.3 | v31.11,8.26 29.84,9.53 29.84,19.05 30.48,19.68 30.48,36.83 29.84,37.47 15.88,37.47 14.61,38.73 SV7.4 | v38.73,8.26 SV8.4
  Bottom 0.254: v53.34,38.73 53.98,38.1 59.69,38.1 62.23,40.64 64.14,40.64 66.67,38.1 67.94,38.1 69.53,39.69 76.52,39.69 77.47,38.73 SV9.4 | v57.15,27.3 55.88,27.3 53.98,29.21 53.98,31.11 RN3.6 IC1.23 | v58.42,8.26 v38.73,8.26 v31.11,8.26 | v50.16,71.75 40.64,71.75 SV6.4
N$57
  Bottom 0.254: 1.91,80.01 0,80.01 0,78.11
N$58
  Top 0.254: 0,1.91 0,0 1.91,0
N$59
  Bottom 0.254: 0,1.91 0,0 1.91,0
N$60
  Bottom 0.254: 78.11,0 80.01,0 80.01,1.91
N$61
  Top 0.254: 78.11,0 80.01,0 80.01,1.91
N$62
  Top 0.254: 78.11,80.01 80.01,80.01 80.01,78.11
N$63
  Bottom 0.254: 78.11,80.01 80.01,80.01 80.01,78.11

### Text on the board
Top: A | C | T | C | L | A | A | DotBlox64-D | C | R | B
Bottom: T | Rev. 1 | DotBlox64-D | L | R | blinkenarea.org | B | http://ebps.de.vu/ | (C) Arne Rossius